# EAGLE schematic nixie clock (EAGLE 6.6.0)
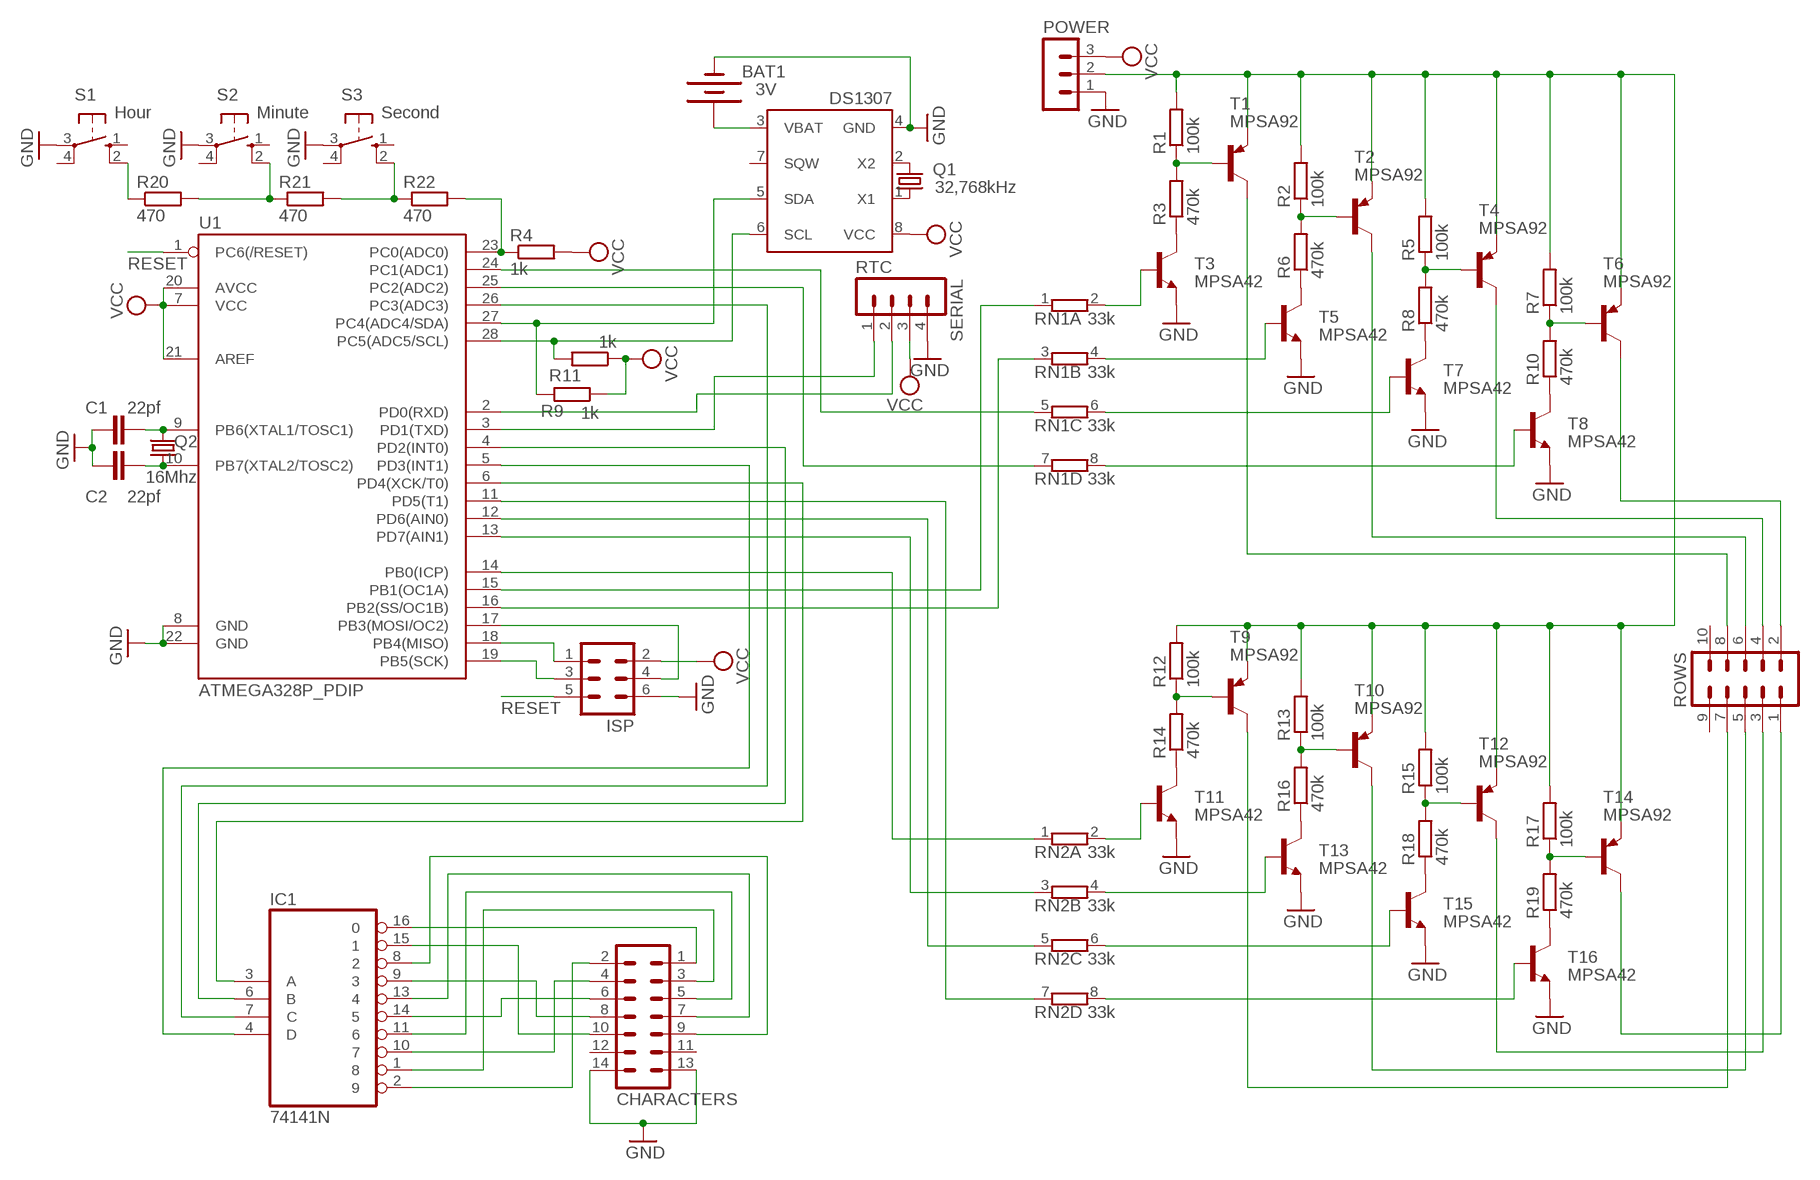
[diagram p0: schematic, sheet 1]

## Parts
BAT1  3V  BATTERY20PTH  [BATTCOM_20MM_PTH]
C1  22pf  CAPEZ  [CAP-PTH-SMALLEZ]
C2  22pf  CAPEZ  [CAP-PTH-SMALLEZ]
CHARACTERS  MA07-2  [MA07-2]
IC1  74141N  [DIL16]
ISP  MA03-2  [MA03-2]
POWER  MA03-1  [MA03-1]
Q1  32,768kHz  CRYSTALTC26V  [TC26V]
Q2  16Mhz  CRYSTALHC49S  [HC49/S]
R1  100k  R-EU_0207/2V  [0207/2V]
R2  100k  R-EU_0207/2V  [0207/2V]
R3  470k  R-EU_0204/7  [0204/7]
R4  1k  R-EU_0204/7  [0204/7]
R5  100k  R-EU_0207/2V  [0207/2V]
R6  470k  R-EU_0204/7  [0204/7]
R7  100k  R-EU_0207/2V  [0207/2V]
R8  470k  R-EU_0204/7  [0204/7]
R9  1k  R-EU_0204/7  [0204/7]
R10  470k  R-EU_0204/7  [0204/7]
R11  1k  R-EU_0204/7  [0204/7]
R12  100k  R-EU_0207/2V  [0207/2V]
R13  100k  R-EU_0207/2V  [0207/2V]
R14  470k  R-EU_0204/7  [0204/7]
R15  100k  R-EU_0207/2V  [0207/2V]
R16  470k  R-EU_0204/7  [0204/7]
R17  100k  R-EU_0207/2V  [0207/2V]
R18  470k  R-EU_0204/7  [0204/7]
R19  470k  R-EU_0204/7  [0204/7]
R20  470  R-EU_0204/7  [0204/7]
R21  470  R-EU_0204/7  [0204/7]
R22  470  R-EU_0204/7  [0204/7]
RN1  33k  E4R  [SIL8]
RN2  33k  E4R  [SIL8]
ROWS  MA05-2  [MA05-2]
RTC  DS1307  [DIL08]
S1  Hour  10-XX  [B3F-10XX]
S2  Minute  10-XX  [B3F-10XX]
S3  Second  10-XX  [B3F-10XX]
SERIAL  MA04-1  [MA04-1]
T1  MPSA92  MPSA92-PNP-TO92-EBC  [TO92-EBC]
T2  MPSA92  MPSA92-PNP-TO92-EBC  [TO92-EBC]
T3  MPSA42  MPSA42-NPN-TO92-EBC  [TO92-EBC]
T4  MPSA92  MPSA92-PNP-TO92-EBC  [TO92-EBC]
T5  MPSA42  MPSA42-NPN-TO92-EBC  [TO92-EBC]
T6  MPSA92  MPSA92-PNP-TO92-EBC  [TO92-EBC]
T7  MPSA42  MPSA42-NPN-TO92-EBC  [TO92-EBC]
T8  MPSA42  MPSA42-NPN-TO92-EBC  [TO92-EBC]
T9  MPSA92  MPSA92-PNP-TO92-EBC  [TO92-EBC]
T10  MPSA92  MPSA92-PNP-TO92-EBC  [TO92-EBC]
T11  MPSA42  MPSA42-NPN-TO92-EBC  [TO92-EBC]
T12  MPSA92  MPSA92-PNP-TO92-EBC  [TO92-EBC]
T13  MPSA42  MPSA42-NPN-TO92-EBC  [TO92-EBC]
T14  MPSA92  MPSA92-PNP-TO92-EBC  [TO92-EBC]
T15  MPSA42  MPSA42-NPN-TO92-EBC  [TO92-EBC]
T16  MPSA42  MPSA42-NPN-TO92-EBC  [TO92-EBC]
U1  ATMEGA328P_PDIP  [DIL28-3]

## Nets
GND: BAT1.2(-) C1.1 C2.1 CHARACTERS.13 CHARACTERS.14 ISP.6 POWER.1 RTC.4(GND) S1.3(P) S2.3(P) S3.3(P) SERIAL.4 T3.E T5.E T7.E T8.E T11.E T13.E T15.E T16.E U1.8(GND) U1.22(GND)
N$1: RN1.2 T3.B
N$2: R3.1 T3.C
N$3: R1.1 R3.2 T1.B
N$4: POWER.2 R1.2 R2.2 R5.2 R7.2 R12.2 R13.2 R15.2 R17.2 T1.E T2.E T4.E T6.E T9.E T10.E T12.E T14.E
N$5: RN1.4 T5.B
N$6: RN1.6 T7.B
N$7: R6.1 T5.C
N$8: R2.1 R6.2 T2.B
N$9: RN1.8 T8.B
N$10: ROWS.8 T1.C
N$11: R14.1 T11.C
N$12: R8.1 T7.C
N$13: R5.1 R8.2 T4.B
N$14: R12.1 R14.2 T9.B
N$15: ROWS.6 T2.C
N$16: R16.1 T13.C
N$17: R10.1 T8.C
N$18: R7.1 R10.2 T6.B
N$19: R13.1 R16.2 T10.B
N$20: ROWS.4 T4.C
N$21: ROWS.2 T6.C
N$22: R18.1 T15.C
N$23: R15.1 R18.2 T12.B
N$24: R20.1 S1.2(S1)
N$25: R19.1 T16.C
N$26: R17.1 R19.2 T14.B
N$27: R20.2 R21.1 S2.2(S1)
N$28: R21.2 R22.1 S3.2(S1)
N$29: RN2.2 T11.B
N$30: RN2.4 T13.B
N$31: RN2.6 T15.B
N$32: RN2.8 T16.B
N$34: CHARACTERS.1 IC1.16
N$35: CHARACTERS.3 IC1.1
N$36: CHARACTERS.5 IC1.11
N$37: CHARACTERS.7 IC1.13
N$38: CHARACTERS.9 IC1.8
N$39: CHARACTERS.2 IC1.2
N$40: CHARACTERS.4 IC1.10
N$41: CHARACTERS.6 IC1.14
N$42: CHARACTERS.8 IC1.9
N$43: CHARACTERS.10 IC1.15
N$44: C1.2 Q2.2 U1.9(PB6(XTAL1/TOSC1))
N$45: ISP.3 U1.19(PB5(SCK))
N$46: ISP.1 U1.18(PB4(MISO))
N$47: ISP.4 U1.17(PB3(MOSI/OC2))
N$48: R9.2 RTC.5(SDA) U1.27(PC4(ADC4/SDA))
N$49: R11.2 RTC.6(SCL) U1.28(PC5(ADC5/SCL))
N$50: Q1.2 RTC.2(X2)
N$51: Q1.1 RTC.1(X1)
N$52: C2.2 Q2.1 U1.10(PB7(XTAL2/TOSC2))
N$53: RN2.7 U1.11(PD5(T1))
N$54: IC1.7(C) U1.26(PC3(ADC3))
N$55: IC1.4(D) U1.5(PD3(INT1))
N$56: IC1.3(A) U1.6(PD4(XCK/T0))
N$57: IC1.6(B) U1.4(PD2(INT0))
N$58: RN2.5 U1.12(PD6(AIN0))
N$59: RN2.3 U1.13(PD7(AIN1))
N$60: RN2.1 U1.14(PB0(ICP))
N$61: RN1.1 U1.15(PB1(OC1A))
N$62: RN1.3 U1.16(PB2(SS/OC1B))
N$63: RN1.5 U1.24(PC1(ADC1))
N$64: RN1.7 U1.25(PC2(ADC2))
N$65: R4.1 R22.2 U1.23(PC0(ADC0))
N$66: BAT1.1(+) RTC.3(VBAT)
N$67: SERIAL.2 U1.2(PD0(RXD))
N$68: SERIAL.1 U1.3(PD1(TXD))
N$69: ROWS.1 T14.C
N$70: ROWS.3 T12.C
N$71: ROWS.5 T10.C
N$72: ROWS.7 T9.C
RESET: ISP.5 U1.1(PC6(/RESET))
VCC: ISP.2 POWER.3 R4.2 R9.1 R11.1 RTC.8(VCC) SERIAL.3 U1.7(VCC) U1.20(AVCC) U1.21(AREF)
Unconnected: CHARACTERS.11 CHARACTERS.12 ROWS.9 ROWS.10 RTC.7(SQW) S1.1(S) S1.4(P1) S2.1(S) S2.4(P1) S3.1(S) S3.4(P1)

## Power pins joined to a net without a drawn wire
GND: IC1.12(GND)
VCC: IC1.5(VCC)

## Library data of the parts
BAT1 = SparkFun-Electromechanical:BATTERY: Battery Holders Various common sizes : AA, AAA, 18650 (PRT-12895), 20mm coin cell and 12mm coin cell. 20MM_4LEGS, BATT-10373
C1 C2 = SparkFun-Capacitors:CAP: Capacitor Standard 0603 ceramic capacitor, and 0.1" leaded capacitor.
CHARACTERS = con-lstb:MA07-2: PIN HEADER; OC_FARNELL: unknown; OC_NEWARK: unknown
IC1 = 74xx-eu:74*141: BCD to decimal DECODER/DRIVER
ISP = con-lstb:MA03-2: PIN HEADER; OC_FARNELL: unknown; OC_NEWARK: unknown
POWER = con-lstb:MA03-1: PIN HEADER; OC_FARNELL: unknown; OC_NEWARK: unknown
Q1 = crystal:CRYSTAL: CRYSTAL; OC_FARNELL: unknown; OC_NEWARK: unknown
Q2 = crystal:CRYSTAL: CRYSTAL; OC_FARNELL: 1667008; OC_NEWARK: unknown
R1-R22 = resistor:R-EU_: RESISTOR, European symbol
RN1 RN2 = resistor-sil:E4R: SIL RESISTOR; OC_FARNELL: unknown; OC_NEWARK: unknown
ROWS = con-lstb:MA05-2: PIN HEADER; OC_FARNELL: unknown; OC_NEWARK: unknown
RTC = ds1307_pcf8583:DS1307: I2C-Bus CLOCK/CALENDAR
S1-S3 = switch-omron:10-XX: OMRON SWITCH; MPN: B3F-1000; OC_FARNELL: 176432; OC_NEWARK: 36M3542
SERIAL = con-lstb:MA04-1: PIN HEADER; OC_FARNELL: unknown; OC_NEWARK: unknown
T1 T2 T4 T6 T9 T10 T12 T14 = transistor:*-PNP-: PNP Transistror
T3 T5 T7 T8 T11 T13 T15 T16 = transistor:*-NPN-: NPN Transistror BF959 corrected 2008.03.06
U1 = SparkFun-DigitalIC:ATMEGA328P_PDIP: uC used in the Arduino 32kb flash, 1k EEPROM, 2k SRAM This is the through-hole version of this chip.